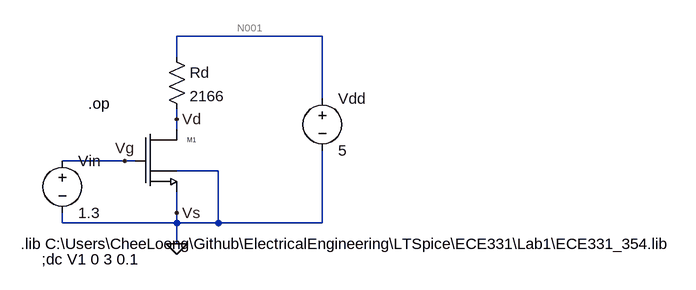
[diagram p0: schematic Lab1_1_3_Soon_Wang.asc]
Lab1_1_3_Soon_Wang.asc, the LTspice schematic file:
Version 4
SHEET 1 1120 680
WIRE 384 -32 160 -32
WIRE 160 0 160 -32
WIRE 384 64 384 -32
WIRE 160 96 160 80
WIRE 160 112 160 96
WIRE 80 160 -16 160
WIRE 96 160 80 160
WIRE 224 176 160 176
WIRE 160 240 160 208
WIRE -16 256 -16 240
WIRE 160 256 160 240
WIRE 160 256 -16 256
WIRE 224 256 224 176
WIRE 224 256 160 256
WIRE 384 256 384 144
WIRE 384 256 224 256
WIRE 160 288 160 256
FLAG 160 288 0
FLAG 160 96 Vd
FLAG 160 240 Vs
FLAG 80 160 Vg
SYMBOL ALD1101 96 112 R0
SYMATTR InstName M1
SYMATTR SpiceModel ""
SYMATTR SpiceLine ""
SYMATTR Value ALD1101
SYMATTR Value2 W=1.379e-3 L=1E-6
SYMBOL voltage -16 144 R0
WINDOW 123 0 0 Left 2
WINDOW 39 0 0 Left 2
SYMATTR InstName Vin
SYMATTR Value 1.3
SYMBOL voltage 384 48 R0
WINDOW 123 0 0 Left 2
WINDOW 39 0 0 Left 2
SYMATTR InstName Vdd
SYMATTR Value 5
SYMBOL res 144 -16 R0
SYMATTR InstName Rd
SYMATTR Value 2166
TEXT -48 312 Left 2 !;dc V1 0 3 0.1
TEXT -80 288 Left 2 !.lib C:\\Users\\CheeLoong\\Github\\ElectricalEngineering\\LTSpice\\ECE331\\Lab1\\ECE331_354.lib
TEXT 24 72 Left 2 !.op

The netlist it stands for:
* Lab1_1_3_Soon_Wang.asc
M1 Vd Vg 0 0 ALD1101 W=1.379e-3 L=1E-6
Vin Vg 0 1.3
Vdd N001 0 5
Rd N001 Vd 2166
.model NMOS NMOS
.model PMOS PMOS
.lib standard.mos
;dc V1 0 3 0.1
.lib C:\Users\CheeLoong\Github\ElectricalEngineering\LTSpice\ECE331\Lab1\ECE331_354.lib
.op
.backanno
.end

* Results of the author's LTspice run, read from the files saved beside the schematic
* Operating Point:
*   V(vd) = 3.17 V
*   V(vg) = 1.3 V
*   V(n001) = 5 V
*   Id(M1) = 844.8 µA
*   Ig(M1) = 0 A
*   Ib(M1) = -3.186 pA
*   Is(M1) = -844.8 µA
*   I(Rd) = 844.8 µA
*   I(Vdd) = -844.8 µA
*   I(Vin) = 0 A
* From the log:
*   Semiconductor Device Operating Points:
*                           --- MOSFET Transistors ---
*   Name:          m1
*   Model:       ald1101
*   Id:          8.45e-04
*   Vgs:         1.30e+00
*   Vds:         3.17e+00
*   Vbs:         0.00e+00
*   Vth:         7.11e-01
*   Vdsat:       4.09e-01
*   Gm:          2.68e-03
*   Gds:         9.70e-06
*   Gmb:         1.29e-03
*   Cbd:         0.00e+00
*   Cbs:         0.00e+00
*   Cgsov:       1.59e-12
*   Cgdov:       1.59e-12
*   Cgbov:       0.00e+00
*   Cgs:         3.17e-12
*   Cgd:         0.00e+00
*   Cgb:         0.00e+00